# Altium schematic sheet Optocuplers.SchDoc: Optocuplers
size A3; CheckedBy: DSokol; DrawnBy: MSokol; Revision: 0.1; SheetNumber: 2; SheetTotal: 3
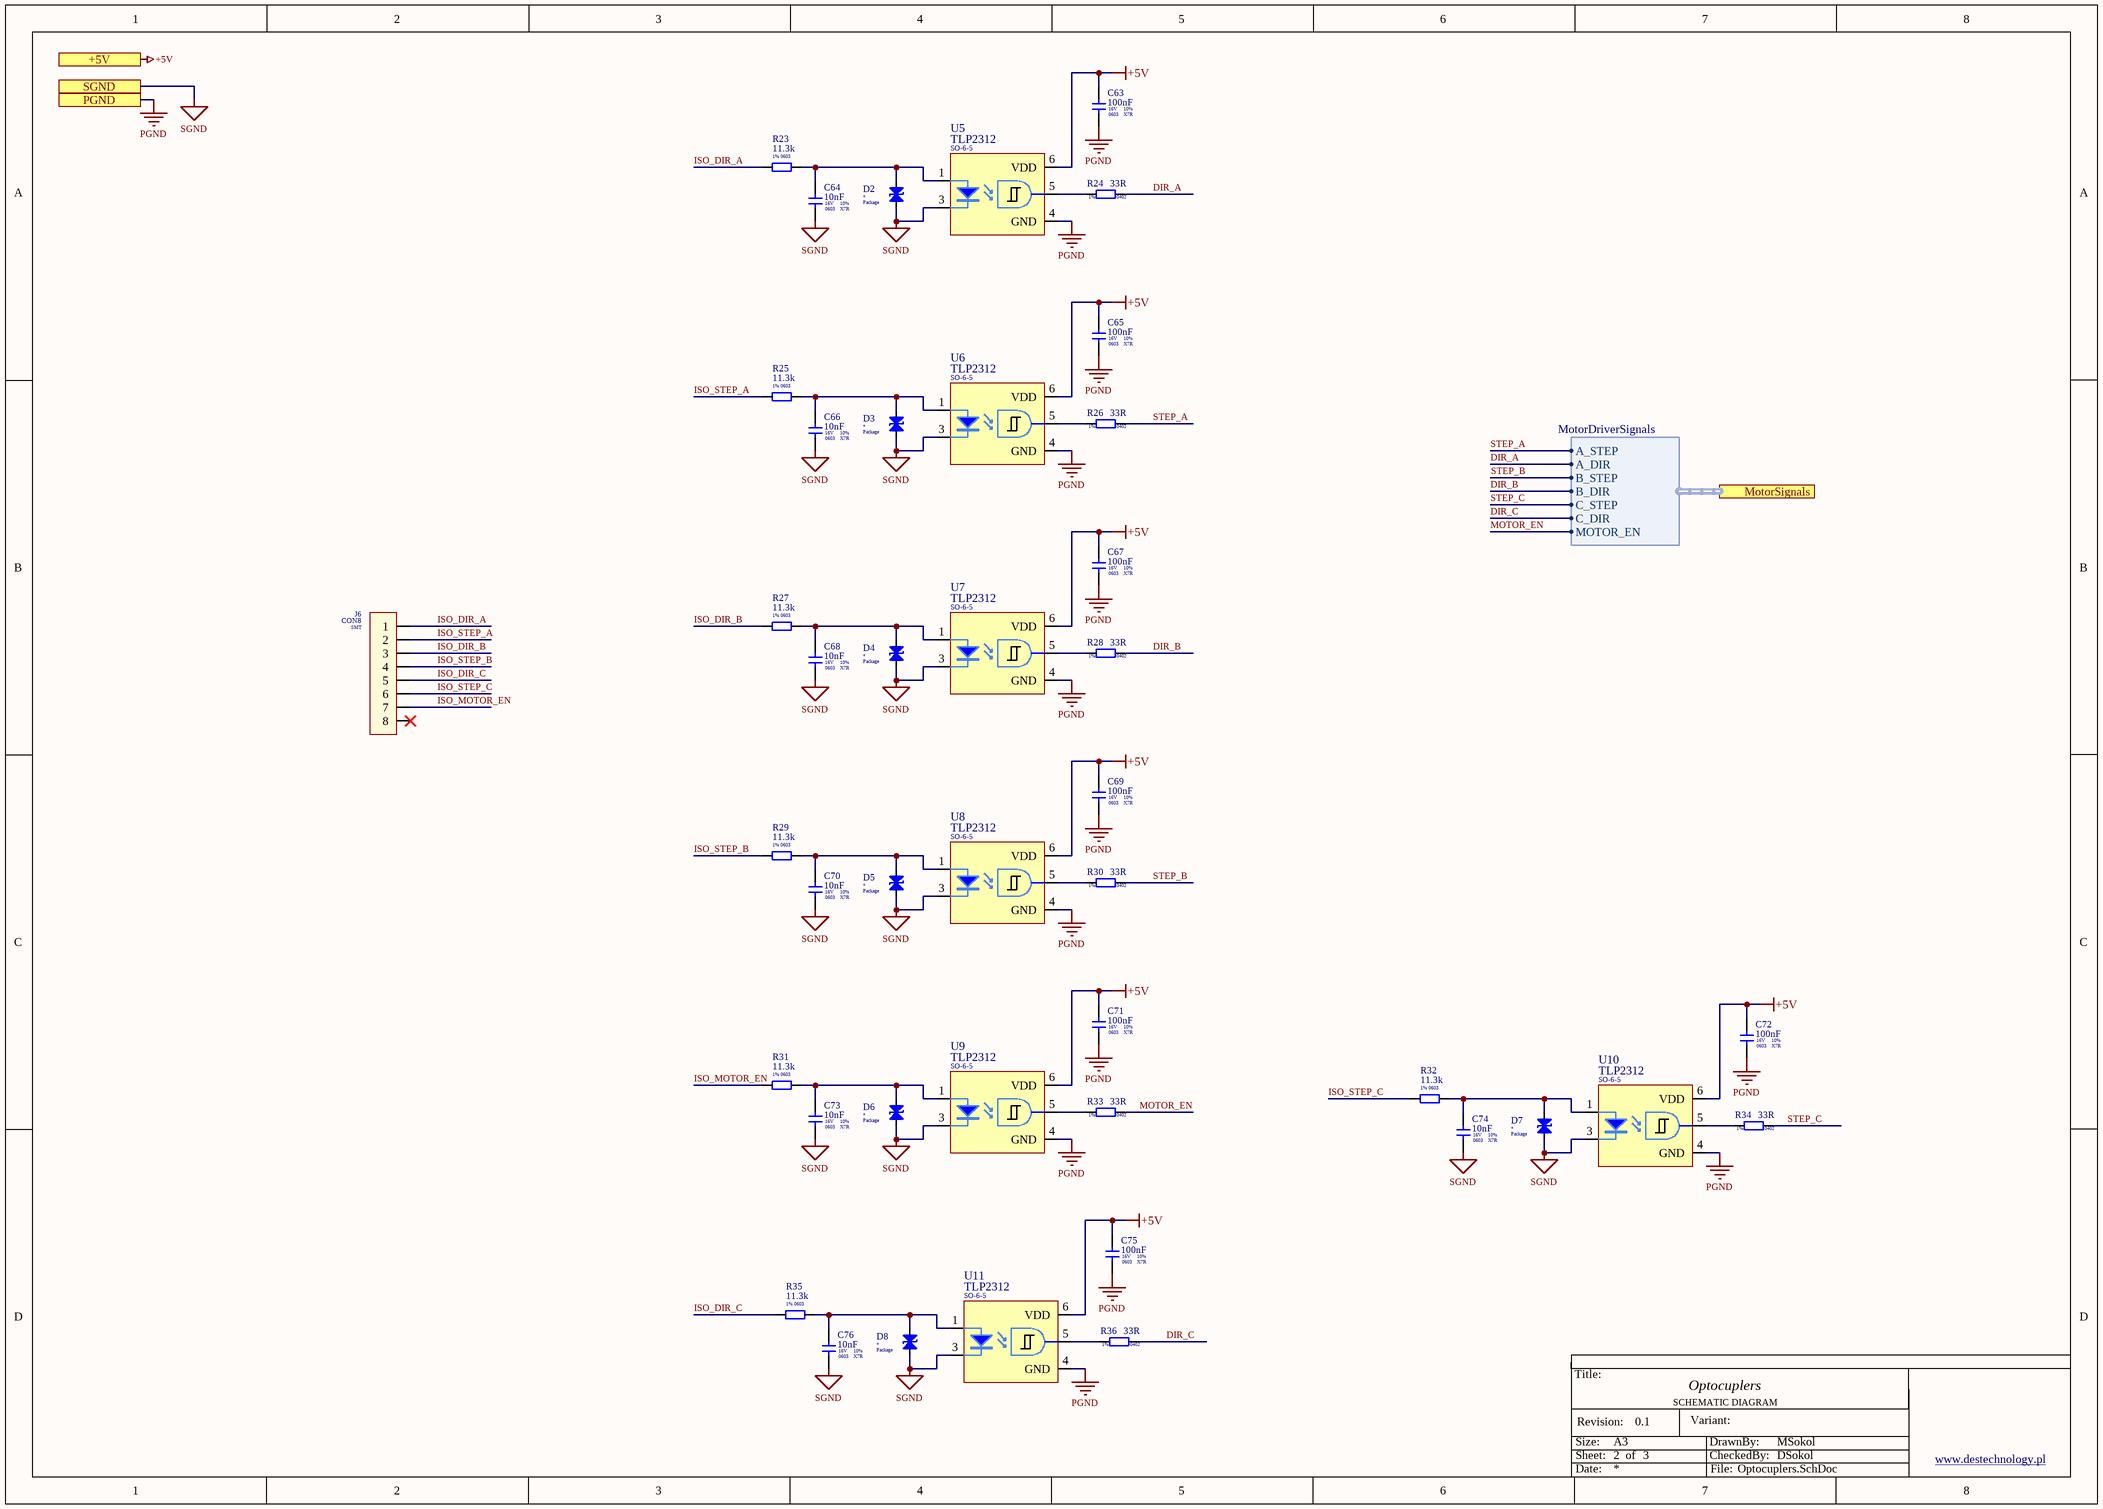
[diagram p0: Optocuplers.SchDoc]

## Parts
C63  value 100nF  DielectricType: X7R  Voltage: 16V  Tolerant: 10%  Package: 0603  [CAPC1608X06M]  (hidden comment: 100nF/16V)
C64  value 10nF  DielectricType: X7R  Voltage: 16V  Tolerant: 10%  Package: 0603  [CAPC1608X06M]  (hidden comment: 10nF/16V)
C65  value 100nF  DielectricType: X7R  Voltage: 16V  Tolerant: 10%  Package: 0603  [CAPC1608X06M]  (hidden comment: 100nF/16V)
C66  value 10nF  DielectricType: X7R  Voltage: 16V  Tolerant: 10%  Package: 0603  [CAPC1608X06M]  (hidden comment: 10nF/16V)
C67  value 100nF  DielectricType: X7R  Voltage: 16V  Tolerant: 10%  Package: 0603  [CAPC1608X06M]  (hidden comment: 100nF/16V)
C68  value 10nF  DielectricType: X7R  Voltage: 16V  Tolerant: 10%  Package: 0603  [CAPC1608X06M]  (hidden comment: 10nF/16V)
C69  value 100nF  DielectricType: X7R  Voltage: 16V  Tolerant: 10%  Package: 0603  [CAPC1608X06M]  (hidden comment: 100nF/16V)
C70  value 10nF  DielectricType: X7R  Voltage: 16V  Tolerant: 10%  Package: 0603  [CAPC1608X06M]  (hidden comment: 10nF/16V)
C71  value 100nF  DielectricType: X7R  Voltage: 16V  Tolerant: 10%  Package: 0603  [CAPC1608X06M]  (hidden comment: 100nF/16V)
C72  value 100nF  DielectricType: X7R  Voltage: 16V  Tolerant: 10%  Package: 0603  [CAPC1608X06M]  (hidden comment: 100nF/16V)
C73  value 10nF  DielectricType: X7R  Voltage: 16V  Tolerant: 10%  Package: 0603  [CAPC1608X06M]  (hidden comment: 10nF/16V)
C74  value 10nF  DielectricType: X7R  Voltage: 16V  Tolerant: 10%  Package: 0603  [CAPC1608X06M]  (hidden comment: 10nF/16V)
C75  value 100nF  DielectricType: X7R  Voltage: 16V  Tolerant: 10%  Package: 0603  [CAPC1608X06M]  (hidden comment: 100nF/16V)
C76  value 10nF  DielectricType: X7R  Voltage: 16V  Tolerant: 10%  Package: 0603  [CAPC1608X06M]  (hidden comment: 10nF/16V)
D2  *  [SODFL250X90-2N]
D3  *  [SODFL250X90-2N]
D4  *  [SODFL250X90-2N]
D5  *  [SODFL250X90-2N]
D6  *  [SODFL250X90-2N]
D7  *  [SODFL250X90-2N]
D8  *  [SODFL250X90-2N]
J6  Package: SMT  [B8B-PH-K-S]  (hidden comment: CON8)
R23  value 11.3k  Package: 0603  Tolerance: 1%  [RESC1608X06M]  (hidden comment: 11.3k 1%)
R24  value 33R  Package: 0402  Tolerance: 1%  [RESC1005X03L]  (hidden comment: 33R 1%)
R25  value 11.3k  Package: 0603  Tolerance: 1%  [RESC1608X06M]  (hidden comment: 11.3k 1%)
R26  value 33R  Package: 0402  Tolerance: 1%  [RESC1005X03L]  (hidden comment: 33R 1%)
R27  value 11.3k  Package: 0603  Tolerance: 1%  [RESC1608X06M]  (hidden comment: 11.3k 1%)
R28  value 33R  Package: 0402  Tolerance: 1%  [RESC1005X03L]  (hidden comment: 33R 1%)
R29  value 11.3k  Package: 0603  Tolerance: 1%  [RESC1608X06M]  (hidden comment: 11.3k 1%)
R30  value 33R  Package: 0402  Tolerance: 1%  [RESC1005X03L]  (hidden comment: 33R 1%)
R31  value 11.3k  Package: 0603  Tolerance: 1%  [RESC1608X06M]  (hidden comment: 11.3k 1%)
R32  value 11.3k  Package: 0603  Tolerance: 1%  [RESC1608X06N]  (hidden comment: 11.3k 1%)
R33  value 33R  Package: 0402  Tolerance: 1%  [RESC1005X03L]  (hidden comment: 33R 1%)
R34  value 33R  Package: 0402  Tolerance: 1%  [RESC1005X03L]  (hidden comment: 33R 1%)
R35  value 11.3k  Package: 0603  Tolerance: 1%  [RESC1608X06M]  (hidden comment: 11.3k 1%)
R36  value 33R  Package: 0402  Tolerance: 1%  [RESC1005X03L]  (hidden comment: 33R 1%)
U5  TLP2312  [SO-6-5]
U6  TLP2312  [SO-6-5]
U7  TLP2312  [SO-6-5]
U8  TLP2312  [SO-6-5]
U9  TLP2312  [SO-6-5]
U10  TLP2312  [SO-6-5]
U11  TLP2312  [SO-6-5]

## Ports
+5V, MotorSignals (harness MotorDriverSignals), PGND, SGND

## Harnesses
MotorDriverSignals: A_STEP, A_DIR, B_STEP, B_DIR, C_STEP, C_DIR, MOTOR_EN

## Nets
+5V: C63.2 C65.2 C67.2 C69.2 C71.2 C72.2 C75.2 U5.6(VDD) U6.6(VDD) U7.6(VDD) U8.6(VDD) U9.6(VDD) U10.6(VDD) U11.6(VDD) ; port +5V
PGND: C63.1 C65.1 C67.1 C69.1 C71.1 C72.1 C75.1 U5.4(GND) U6.4(GND) U7.4(GND) U8.4(GND) U9.4(GND) U10.4(GND) U11.4(GND) ; port PGND
SGND: C64.1 C66.1 C68.1 C70.1 C73.1 C74.1 C76.1 D2.1(A) D3.1(A) D4.1(A) D5.1(A) D6.1(A) D7.1(A) D8.1(A) U5.3(K) U6.3(K) U7.3(K) U8.3(K) U9.3(K) U10.3(K) U11.3(K) ; port SGND
DIR_A: R24.1 ; port MotorSignals.A_DIR
DIR_B: R28.1 ; port MotorSignals.B_DIR
DIR_C: R36.1 ; port MotorSignals.C_DIR
ISO_DIR_A: J6.1 R23.1
ISO_DIR_B: J6.3 R27.1
ISO_DIR_C: J6.5 R35.1
ISO_MOTOR_EN: J6.7 R31.1
ISO_STEP_A: J6.2 R25.1
ISO_STEP_B: J6.4 R29.1
ISO_STEP_C: J6.6 R32.1
MOTOR_EN: R33.1 ; port MotorSignals.MOTOR_EN
STEP_A: R26.1 ; port MotorSignals.A_STEP
STEP_B: R30.1 ; port MotorSignals.B_STEP
STEP_C: R34.1 ; port MotorSignals.C_STEP
NetC64_2: C64.2 D2.2(K) R23.2 U5.1(A)
NetC66_2: C66.2 D3.2(K) R25.2 U6.1(A)
NetC68_2: C68.2 D4.2(K) R27.2 U7.1(A)
NetC70_2: C70.2 D5.2(K) R29.2 U8.1(A)
NetC73_2: C73.2 D6.2(K) R31.2 U9.1(A)
NetC74_2: C74.2 D7.2(K) R32.2 U10.1(A)
NetC76_2: C76.2 D8.2(K) R35.2 U11.1(A)
NetR24_2: R24.2 U5.5(Vo)
NetR26_2: R26.2 U6.5(Vo)
NetR28_2: R28.2 U7.5(Vo)
NetR30_2: R30.2 U8.5(Vo)
NetR33_2: R33.2 U9.5(Vo)
NetR34_2: R34.2 U10.5(Vo)
NetR36_2: R36.2 U11.5(Vo)

Not connected (* = marked no-connect by the designer): J6 8*

## Notes on the sheet
- Title:
- Size:
- Sheet:
- Revision:
- A3
- of
- SCHEMATIC DIAGRAM
- Variant:
- DrawnBy:
- CheckedBy:
- www.destechnology.pl <http://www.destechnology.pl>
- Date:
- File:

## Library data of the parts
C63-C76 = C: Supplier Part Number 1: *
D2-D8 = D_TRANSIL1: Manufacture: *; helpurl: *; Package: Package; value: *
J6 = CON_8PIN: value: CON8
R23-R36 = R
  R23 R25 R27 R29 R31 R32 R35: Supplier Part Number 1: *
  R24 R26 R28 R30 R33 R34 R36: Supplier Part Number 1: CRCW040233R0FKED
U5-U11 = TLP2312: High Speed Optocouplers High speed photocoupler; 5pin SO6; manufacturer: Toshiba; helpurl: https://www.mouser.pl/datasheet/3/105/1/D78E77339B69F00393F891A3B84C497312BF0481D7045F2AF290AB6A5F48831E.pdf; case: SO-6-5; value: TLP2312